# EAGLE design master (EAGLE 7.0.0)
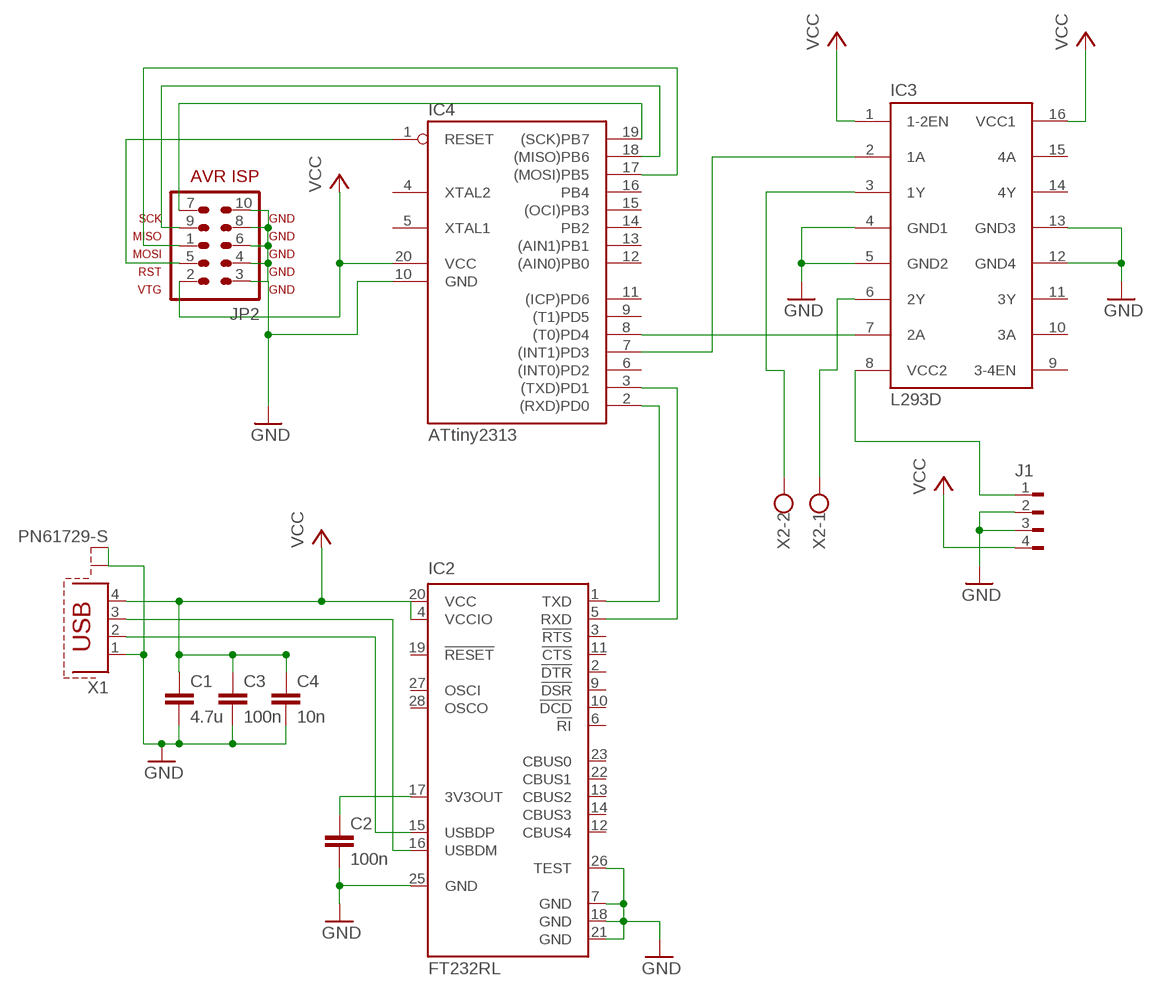
[diagram p0: schematic, sheet 1]

## Parts
C1  4.7u  C-EU025-025X050  [C025-025X050]
C2  100n  C-EU025-025X050  [C025-025X050]
C3  100n  C-EU025-025X050  [C025-025X050]
C4  10n  C-EU025-025X050  [C025-025X050]
IC2  FT232RL  [SSOP28]
IC3  L293D  [DIL16]
IC4  ATtiny2313  AT90S2313S  [SO20L]
J1  FLOPPY-4  [FLOPPY-4]
JP2  AVR-ISP-10  [AVR-ISP-10]
X1  PN61729-S  [PN61729-S]
X2  W237-102  [W237-102]

## Nets
GND: C1.2 C2.2 C3.2 C4.2 IC2.7(GND) IC2.18(GND) IC2.21(GND) IC2.25(GND) IC2.26(TEST) IC3.4(GND1) IC3.5(GND2) IC3.12(GND4) IC3.13(GND3) IC4.10(GND) J1.2 J1.3 JP2.3 JP2.4 JP2.6 JP2.8 JP2.10 X1.1 X1.S1 X1.S2
N$1: IC2.1(TXD) IC4.2((RXD)PD0)
N$2: IC2.16(USBDM) X1.3
N$3: IC2.15(USBDP) X1.2
N$4: C2.1 IC2.17(3V3OUT)
N$5: IC2.5(RXD) IC4.3((TXD)PD1)
N$6: IC4.1(RESET) JP2.5
N$7: IC3.8(VCC2) J1.1
N$8: IC4.18((MISO)PB6) JP2.9
N$9: IC3.7(2A) IC4.8((T0)PD4)
N$10: IC4.17((MOSI)PB5) JP2.1
N$11: IC4.19((SCK)PB7) JP2.7
N$12: IC3.2(1A) IC4.7((INT1)PD3)
N$14: IC3.3(1Y) X2.2
N$15: IC3.6(2Y) X2.1
VCC: C1.1 C3.1 C4.1 IC2.4(VCCIO) IC2.20(VCC) IC3.1(1-2EN) IC3.16(VCC1) IC4.20(VCC) J1.4 JP2.2 X1.4
Unconnected: IC2.2(!DTR) IC2.3(!RTS) IC2.6(!RI) IC2.9(!DSR) IC2.10(!DCD) IC2.11(!CTS) IC2.12(CBUS4) IC2.13(CBUS2) IC2.14(CBUS3) IC2.19(!RESET) IC2.22(CBUS1) IC2.23(CBUS0) IC2.27(OSCI) IC2.28(OSCO) IC3.9(3-4EN) IC3.10(3A) IC3.11(3Y) IC3.14(4Y) IC3.15(4A) IC4.4(XTAL2) IC4.5(XTAL1) IC4.6((INT0)PD2) IC4.9((T1)PD5) IC4.11((ICP)PD6) IC4.12((AIN0)PB0) IC4.13((AIN1)PB1) IC4.14(PB2) IC4.15((OCI)PB3) IC4.16(PB4)

## Library data of the parts
C1-C4 = resistor:C-EU: CAPACITOR, European symbol
IC2 = ftdichip:FT232R: Source: http://www.ftdichip.com/Documents/DataSheets/DS_FT232R_v104.pdf; MPN: FT232RL; OC_FARNELL: 1146032; OC_NEWARK: 91K9918
IC3 = st-microelectronics:L293D: PUSH-PULL 4 CHANNEL DRIVER; MPN: L293D; OC_FARNELL: 9589619; OC_NEWARK: 56P8249
IC4 = atmel:AT90S2313: MICROCONTROLLER 2 Kbytes FLASH 128 bytes SRAM 128 bytes EEPROM UART; OC_FARNELL: unknown; OC_NEWARK: unknown
J1 = con-amp:FLOPPY-4: MATE N-LOCK Floppy / HDD conector Distributor: Bürklin 71F970
JP2 = avr-7:AVR-ISP-10: AVR ISP-10 Serial Programming Header
X1 = con-berg:PN61729-S: BERG USB connector; OC_FARNELL: unknown; OC_NEWARK: unknown
X2 = con-wago-500:W237-102: WAGO SCREW CLAMP; MPN: 237-102; OC_FARNELL: unknown; OC_NEWARK: 70K9898

## Board
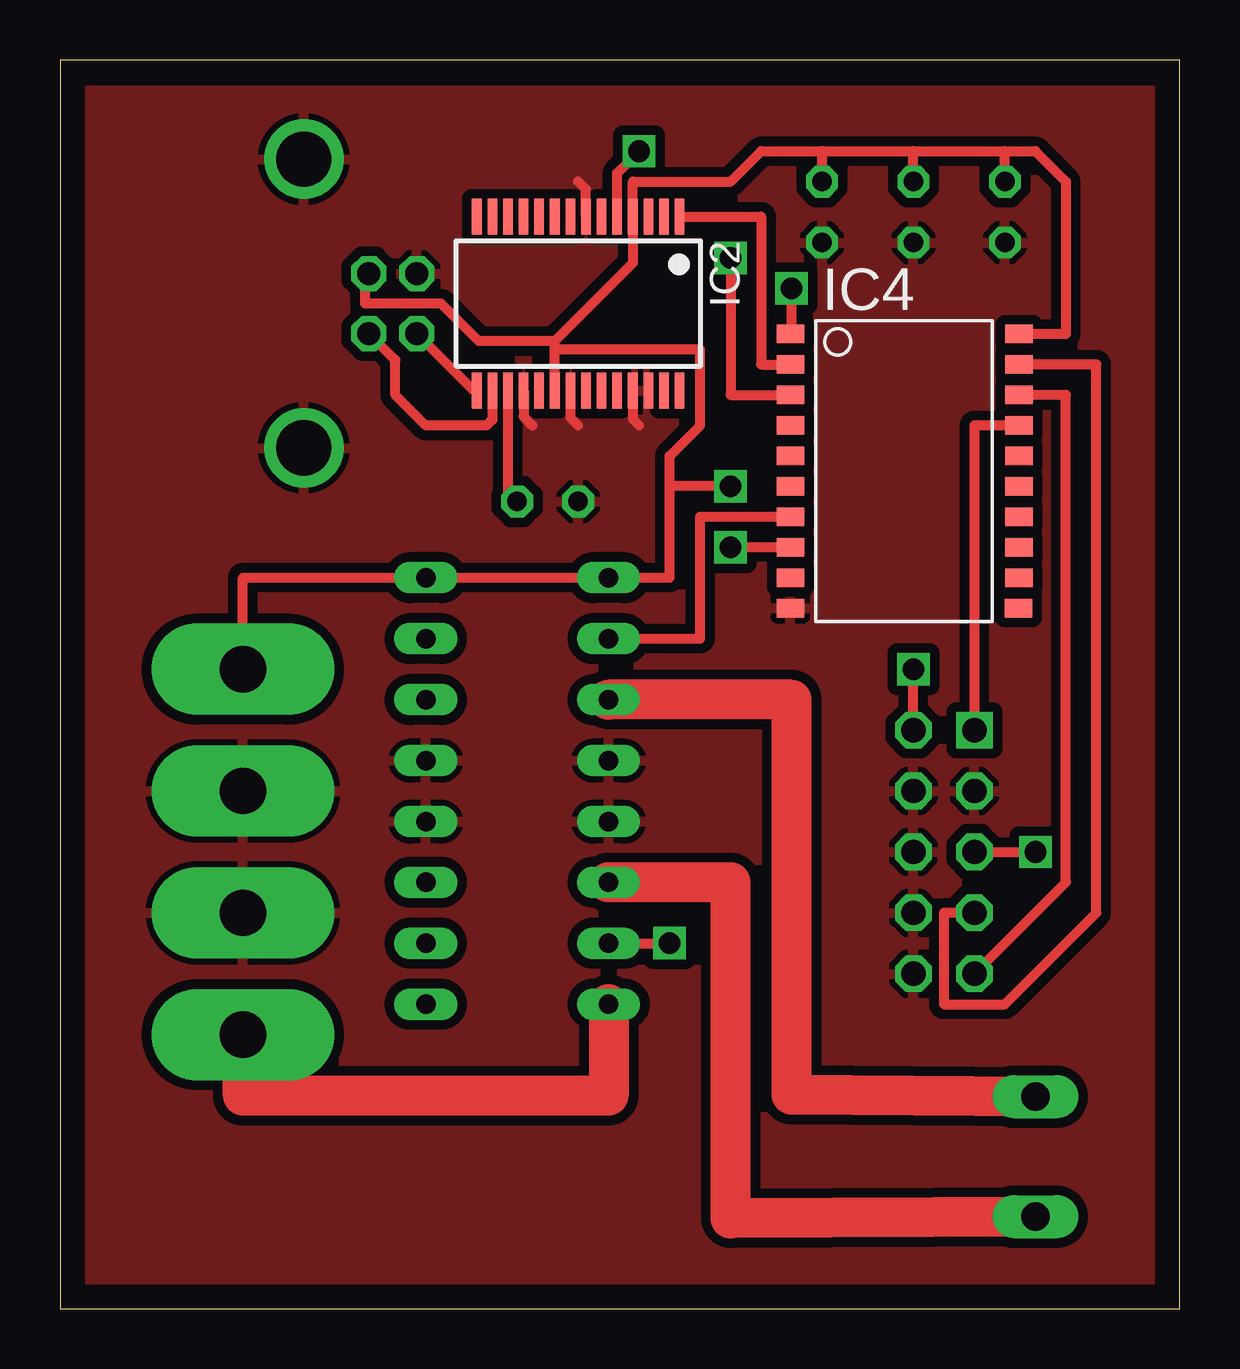
[diagram p1: board, top side]
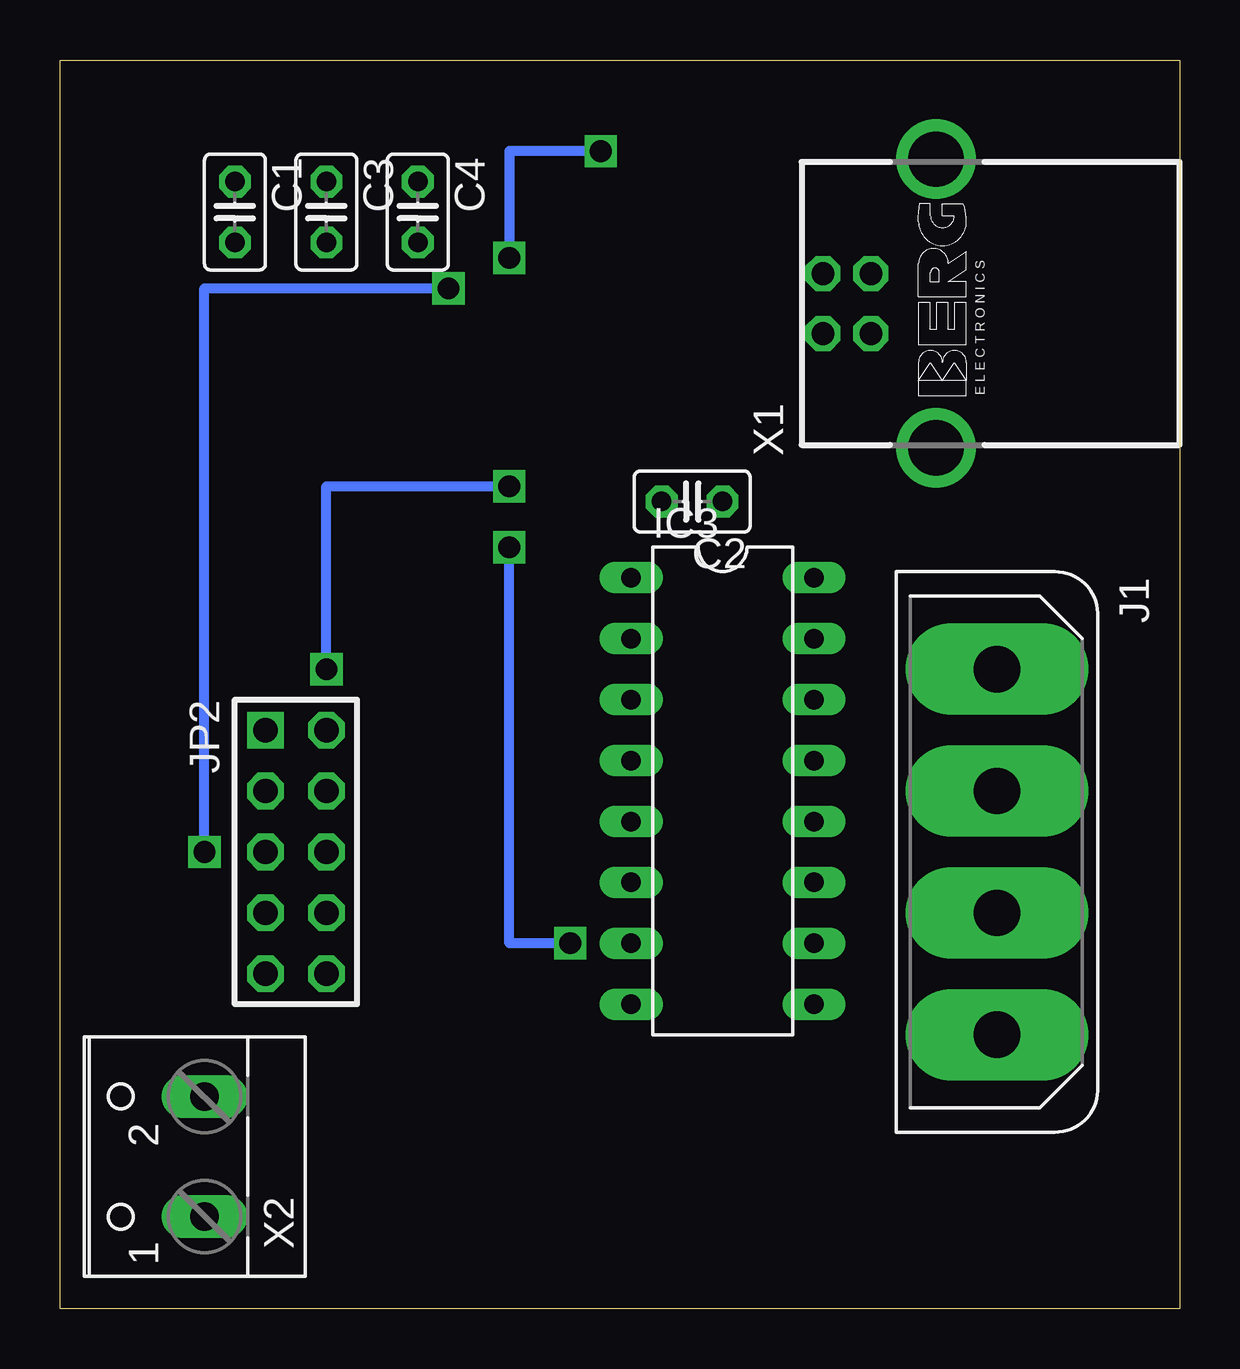
[diagram p2: board, bottom side, seen from below]

Size 46.66 x 52.06 mm. Coordinates in mm from the lower left corner, seen from the top.
Outline: 0,0 46.66,0 46.66,52.06 0,52.06 0,0
Copper layers (1*16): Top 0.035mm / dielectric 1.5mm / Bottom 0.035mm
Design rules "default": minimum track width 10mil, minimum drill 24mil, track to track 8mil, track to pad 8mil, pad to pad 8mil, via to via 8mil, smd to smd 8mil, copper to edge 40mil, drill to drill 8mil, minimum pad ring 10mil, minimum via ring 8mil, stop-mask expansion 4mil, vias tented up to drill 0mil, thermal gap 10mil

### Footprints (pad centres in the part's own frame; a part is rotated, then mirrored left to right if it is on the bottom)
C025-025X050 = drill 0.813 octagon: 1 -1.27,0; 2 1.27,0
SSOP28 = smd 0.4 x 1.5: 1 -4.225,-3.625; 2 -3.575,-3.625; 3 -2.925,-3.625; 4 -2.275,-3.625; 5 -1.625,-3.625; 6 -0.975,-3.625; 7 -0.325,-3.625; 8 0.325,-3.625; 9 0.975,-3.625; 10 1.625,-3.625; 11 2.275,-3.625; 12 2.925,-3.625; 13 3.575,-3.625; 14 4.225,-3.625; 15 4.225,3.625; 16 3.575,3.625; 17 2.925,3.625; 18 2.275,3.625; 19 1.625,3.625; 20 0.975,3.625; 21 0.325,3.625; 22 -0.325,3.625; 23 -0.975,3.625; 24 -1.625,3.625; 25 -2.275,3.625; 26 -2.925,3.625; 27 -3.575,3.625; 28 -4.225,3.625
DIL16 = drill 0.813 long: 1 -8.89,-3.81; 2 -6.35,-3.81; 3 -3.81,-3.81; 4 -1.27,-3.81; 5 1.27,-3.81; 6 3.81,-3.81; 7 6.35,-3.81; 8 8.89,-3.81; 9 8.89,3.81; 10 6.35,3.81; 11 3.81,3.81; 12 1.27,3.81; 13 -1.27,3.81; 14 -3.81,3.81; 15 -6.35,3.81; 16 -8.89,3.81
SO20L = smd 0.762 x 1.143: 1 -5.08,-5.131; 2 -3.81,-5.131; 3 -2.54,-5.131; 4 -1.27,-5.131; 5 0,-5.131; 6 1.27,-5.131; 7 2.54,-5.131; 8 3.81,-5.131; 9 5.08,-5.131; 10 6.35,-5.131; 11 6.35,4.369; 12 5.08,4.394; 13 3.81,4.394; 14 2.54,4.394; 15 1.27,4.394; 16 0,4.394; 17 -1.27,4.394; 18 -2.54,4.394; 19 -3.81,4.394; 20 -5.08,4.394
FLOPPY-4 = drill 1.93 pad 3.81 long: 1 7.62,0; 2 2.54,0; 3 -2.54,0; 4 -7.62,0
AVR-ISP-10 = drill 1.016 square: 1 -5.08,-1.27 | drill 1.016 octagon: 2 -5.08,1.27; 3 -2.54,-1.27; 4 -2.54,1.27; 5 0,-1.27; 6 0,1.27; 7 2.54,-1.27; 8 2.54,1.27; 9 5.08,-1.27; 10 5.08,1.27
PN61729-S = drill 0.95 octagon: 1 1.25,4.71; 2 -1.25,4.71; 3 -1.25,2.71; 4 1.25,2.71 | drill 2.3 pad 2.9: S1 -6.02,0; S2 6.02,0
W237-102 = drill 1.194 long: 1 -2.5,-1.27; 2 2.5,-1.27

### Placement (x,y rotation side)
C1  39.37,45.72 270 bottom
C2  20.32,33.66 180 bottom
C3  35.56,45.72 270 bottom
C4  31.75,45.72 270 bottom
IC2  21.59,41.91 180 top
IC3  19.05,21.59 270 bottom
IC4  35.56,35.56 270 top
J1  7.62,19.05 270 bottom
JP2  36.83,19.05 270 bottom
X1  10.16,41.91 90 bottom
X2  41.91,6.35 90 bottom

### Tracks (layer width: path | path; a pad name or v marks a point on that pad's centre or on a via)
GND
  Top 0.406: IC2.25 23.86,37.09 24.13,36.83 | IC2.21 21.27,37.16 21.59,36.83 | IC2.18 19.32,37.2 19.68,36.83 | IC2.7 21.91,46.66 21.59,46.99
  pour Top (isolate 0.406): 0,50.8 45.72,50.8 45.72,0 0,0
N$1
  Top 0.406: IC2.1 29.21,45.53 29.21,39.37 IC4.2
N$2
  Top 0.406: IC2.16 18.02,37.06 17.78,36.83 15.24,36.83 13.97,38.1 13.97,39.56 X1.3
N$3
  Top 0.406: IC2.15 17.25,38.28 X1.2
N$4
  Top 0.406: IC2.17 18.66,34.04 C2.1
N$5  (via drill 0.9)
  Top 0.406: v27.94,43.81 27.94,38.1 IC4.3 | IC2.5 23.21,47.34 v24.13,48.26
  Bottom 0.406: v24.13,48.26 27.94,48.26 v27.94,43.81
N$6  (via drill 0.9)
  Top 0.406: JP2.5 v40.64,19.05 | IC4.1 30.48,40.64 v30.48,42.55
  Bottom 0.406: v40.64,19.05 40.64,42.55 v30.48,42.55
N$7
  Top 1.676: IC3.8 22.86,8.89 7.62,8.89 J1.1
N$8
  Top 0.406: IC4.18 41.91,38.1 41.91,17.78 JP2.9
N$9  (via drill 0.9)
  Top 0.406: IC3.7 v25.4,15.24 | v27.94,31.75 IC4.8
  Bottom 0.406: v25.4,15.24 27.94,15.24 v27.94,31.75
N$10
  Top 0.406: IC4.17 38.1,36.83 JP2.1
N$11
  Top 0.406: JP2.7 36.83,16.51 36.83,12.7 39.37,12.7 43.18,16.51 43.18,39.37 IC4.19
N$12
  Top 0.406: IC3.2 26.67,27.94 26.67,33.02 IC4.7
N$14
  Top 1.676: IC3.3 30.48,25.4 30.48,8.93 X2.2
N$15
  Top 1.676: X2.1 27.94,3.77 27.94,17.78 IC3.6
VCC  (via drill 0.9)
  Top 0.406: IC2.20 20.61,40.01 | 20.61,40.01 20.61,40.34 | 20.61,40.34 23.86,43.59 IC2.4 23.86,46.99 27.94,46.99 29.21,48.26 31.75,48.26 | 20.61,40.01 26.67,40.01 26.67,36.83 25.4,35.56 25.4,34.29 | IC4.20 41.91,40.64 41.91,46.99 40.64,48.26 39.37,48.26 | JP2.2 v35.56,26.67 | v27.94,34.29 25.4,34.29 | 25.4,34.29 25.4,30.48 IC3.1 IC3.16 7.62,30.48 J1.4 | X1.4 12.7,43.16 12.7,41.91 15.88,41.91 17.44,40.34 20.61,40.34 | C4.1 31.75,48.26 | 31.75,48.26 35.56,48.26 | C3.1 35.56,48.26 | 35.56,48.26 39.37,48.26 | C1.1 39.37,48.26
  Bottom 0.406: v35.56,26.67 35.56,34.29 v27.94,34.29